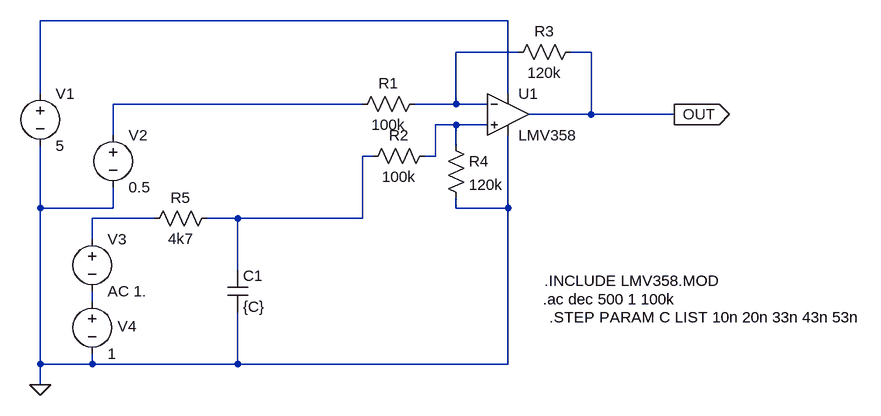
[diagram p0: schematic vetrnik-current-sensor-opamp.asc]
vetrnik-current-sensor-opamp.asc, the LTspice schematic file:
Version 4
SHEET 1 964 680
WIRE 304 -48 -416 -48
WIRE 320 0 224 0
WIRE 432 0 400 0
WIRE -416 64 -416 -48
WIRE 304 64 304 -48
WIRE 80 80 -304 80
WIRE 224 80 224 0
WIRE 224 80 160 80
WIRE 272 80 224 80
WIRE 432 96 432 0
WIRE 432 96 336 96
WIRE 560 96 432 96
WIRE 224 112 192 112
WIRE 272 112 224 112
WIRE -304 128 -304 80
WIRE 224 144 224 112
WIRE 96 160 80 160
WIRE 192 160 192 112
WIRE 192 160 176 160
WIRE -416 240 -416 144
WIRE -304 240 -304 208
WIRE -304 240 -416 240
WIRE 224 240 224 224
WIRE 304 240 304 128
WIRE 304 240 224 240
WIRE -240 256 -336 256
WIRE -112 256 -160 256
WIRE 80 256 80 160
WIRE 80 256 -112 256
WIRE -336 288 -336 256
WIRE -112 336 -112 256
WIRE -336 384 -336 368
WIRE -416 480 -416 240
WIRE -336 480 -336 464
WIRE -336 480 -416 480
WIRE -112 480 -112 400
WIRE -112 480 -336 480
WIRE 304 480 304 240
WIRE 304 480 -112 480
WIRE -416 512 -416 480
FLAG -416 512 0
FLAG 560 96 OUT
IOPIN 560 96 Out
SYMBOL OpAmps\\opamp2 304 32 R0
SYMATTR InstName U1
SYMATTR Value LMV358
SYMBOL voltage -416 48 R0
SYMATTR InstName V1
SYMATTR Value 5
SYMBOL res 176 64 R90
WINDOW 0 0 56 VBottom 2
WINDOW 3 32 56 VTop 2
SYMATTR InstName R1
SYMATTR Value 100k
SYMBOL res 192 144 R90
WINDOW 0 0 56 VBottom 2
WINDOW 3 32 56 VTop 2
SYMATTR InstName R2
SYMATTR Value 100k
SYMBOL res 416 -16 R90
WINDOW 0 0 56 VBottom 2
WINDOW 3 32 56 VTop 2
SYMATTR InstName R3
SYMATTR Value 120k
SYMBOL res 208 128 R0
SYMATTR InstName R4
SYMATTR Value 120k
SYMBOL voltage -304 112 R0
SYMATTR InstName V2
SYMATTR Value 0.5
SYMBOL voltage -336 272 R0
WINDOW 123 25 122 Left 2
WINDOW 39 0 0 Left 0
SYMATTR InstName V3
SYMATTR Value AC 1.
SYMBOL voltage -336 368 R0
WINDOW 0 39 54 Left 2
SYMATTR InstName V4
SYMATTR Value 1
SYMBOL res -144 240 R90
WINDOW 0 0 56 VBottom 2
WINDOW 3 32 56 VTop 2
SYMATTR InstName R5
SYMATTR Value 4k7
SYMBOL cap -128 336 R0
SYMATTR InstName C1
SYMATTR Value {C}
TEXT 360 352 Left 2 !.INCLUDE LMV358.MOD
TEXT 358 380 Left 2 !.ac dec 500 1 100k
TEXT 368 408 Left 2 !.STEP PARAM C LIST 10n 20n 33n 43n 53n

The netlist it stands for:
* vetrnik-current-sensor-opamp.asc
XU1 N004 N002 N001 0 OUT LMV358  ; pins In+ In- V+ V- OUT
V1 N001 0 5
R1 N002 N003 100k
R2 N004 N005 100k
R3 OUT N002 120k
R4 N004 0 120k
V2 N003 0 0.5
V3 N006 N007 AC 1.
V4 N007 0 1
R5 N005 N006 4k7
C1 N005 0 {C}
.INCLUDE LMV358.MOD
.ac dec 500 1 100k
.STEP PARAM C LIST 10n 20n 33n 43n 53n
.backanno
.end